# Altium project SiPM_ASSY2.PrjPCB
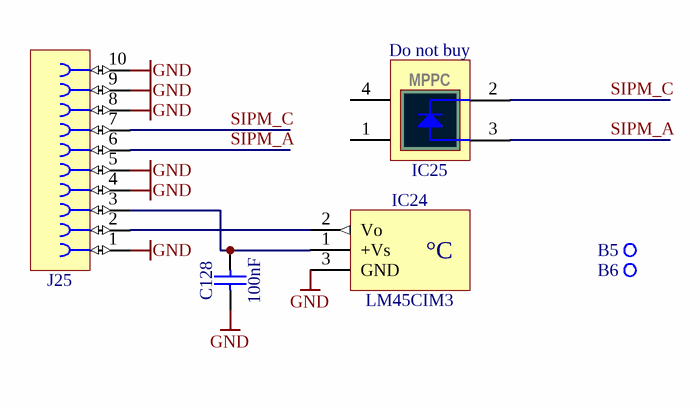
[diagram p0: SiPM_ASSY2.SchDoc]
1 sheet, 6 parts. Net scope: hierarchical (ports join the sheet entries above them; power ports are global).
Board file: SiPM_ASSY2.PCBDOC

## Sheet SiPM_ASSY2.SchDoc: MCORD AFE
size 420 x 297 mm; Author: G.Kasprowicz; CompanyName: WUT ISE; DrawnBy: G.Kasprowicz; Organization: WUT ISE; Address1: PW ISE; Address2: Nowowiejska 15/19 00-665 Warsaw; Address3: gkasprow@gmail.com; DocumentNumber: 1; Revision: 2; SheetNumber: 1; SheetTotal: 4; ModifiedBy: -; CheckedDate: -; Title2: top; DivGrp: WUT ISE; Designer: G.Kasprowicz; ModifiedDate: -; ProjectName: Sensor Box

### Parts
B5  Plated Hole  [MTG270_500]  (value not drawn)  (no BOM)
B6  Plated Hole  [MTG270_500]  (value not drawn)  (no BOM)
C128  100nF  [CAPC1005X55N]
IC24  LM45CIM3  [SOT95P251X112-3N]
IC25  Do not buy  [HAMAMATSU_S13360-1325PE]
J25  FFC/FPC  [MOLEX_52745-1097]  (value not drawn)

### Nets
GND: C128.1 IC24.3(GND) J25.1 J25.4 J25.5 J25.8 J25.9 J25.10
SIPM_A: IC25.3(A) J25.6
SIPM_C: IC25.2(C) J25.7
NetC128_2: C128.2 IC24.1(+Vs) J25.3
NetIC24_2: IC24.2(Vo) J25.2

Not connected (* = marked no-connect by the designer): B5 1; B6 1; IC25 1(NC) 4(NC)

### Notes on the sheet
- Project/Equipment
- Document
- Designer
- Drawn by
- Check.by
- Copyright WUT ISE 2018.
  This documentation describes Open Hardware and is licensed under the CERN OHL v.1.1. You may redistribute and modify this documentation under the terms of the CERN OHL v.1.1. (http://ohwr.org/CERNOHL). This documentation is distributed WITHOUT ANY EXPRESS OR IMPLIED WARRANTY, INCLUDING OF MERCHANTABILITY, SATISFACTORY QUALITY AND FITNESS FOR A PARTICULAR PURPOSE. Please see the CERN OHL v.1.1 for applicable conditions.
- Contact
- File
- Last Mod.
- Print Date
- Sheet
- Size
- A3
- of
- Rev
- (in symbol LM45CIM3) °C
- (in symbol SENS_S13360-1325PE) MPPC

### Library data of the parts
B5 B6 = PLATED_HOLE2.7_PAD5.0: Single Terminal Socket; Part Description: Plated Through Hole: Hole Dia.=2.7mm Pad Dia.=5.0mm; Mounted: No; Part Number: PLATED_HOLE2.7_PAD5.0; Component Type: Standard (No BOM); Pin Count: 1; Family: Plated Hole; Socket: No; SMD: No; Sense: No; Status: None; ComponentHeight: 0mm; HelpURL: Undefined; Author: CERN DEM JMW; CreateDate: 27.09.2011; LatestRevisionDate: 27.09.2011; PackageDescription: Plated Through Hole: Hole Dia.=2.7mm Pad Dia.=5.0mm
C128 = CC0402_100NF_16V_10%_X7R: Non-polarised capacitor; Part Description: SMD Multilayer Chip Ceramic Capacitor; Manufacturer: GENERIC; Manufacturer1 Part Number: GRM155R71C104KA88D; Voltage: 16V; TC: X7R; Tolerance: ±10%; Part Number: CC0402_100NF_16V_10%_X7R; Component Kind: Standard; Component Type: Standard; Pin Count: 2; Value: 100nF; Status: Not Recommended; Manufacturer Part Number: CC0402_100NF_16V_10%_X7R; Case: 0402; Mounted: Yes; Socket: No; SMD: Yes; Sense: No; HelpURL: \\cern.ch\dfs\Applications\Altium\Datasheets\CC0402_X7R_MURATA_GRM.pdf; Author: CERN DEM JLC; CreateDate: 05.12.2013; LatestRevisionDate: 03.12.2007; Manufacturer1 Example: MURATA; Manufacturer1 ComponentHeight: 0.55mm
IC24 = LM45CIM3: -20° to +100°C ±3°C Precision Centigrade Temperature Sensors; Manufacturer: NATIONAL SEMICONDUCTOR; PressFit: No; Bonding: No; Part Number: LM45CIM3; Component Kind: Standard; Component Type: Standard; Device: LM45CIM3; PackageDescription: SOT23 3-Leads, Pitch 0.95mm - Body 1.3x2.9mm, IPC Medium Density; Status: Obsolete; Part Description: -20° to +100°C ±3°C Precision Centigrade Temperature Sensors; Manufacturer Part Number: LM45CIM3; Pin Count: 3; Case: SOT23; Mounted: Yes; Socket: No; SMD: Yes; Sense: No; ComponentHeight: 1.12mm; HelpURL: \\cern.ch\dfs\Applications\Altium\Datasheets\LM45CIM3.pdf; Author: CERN DEM JLC; CreateDate: 02.12.2009; LatestRevisionDate: 02.12.2009
IC25 = SENS_S13360-1325PE: MPPC (Multi-Pixel Photon Counter); Part Description: 1.3 x 1.3mm2, 25µm Pixel Pitch, SMD MPPC (Multi-Pixel Photon Counter); Manufacturer: HAMAMATSU; PressFit: No; Bonding: No; Part Number: S13360-1325PE; Component Kind: Standard; Component Type: Standard; Device: S13360-1325PE; PackageDescription: 1.3 x 1.3mm2, 25µm Pixel Pitch, SMD MPPC (Multi-Pixel Photon Counter, Body 2.1mm x mm x 2.625mm x 1mm; Manufacturer Part Number: S13360-1325PE; Pin Count: 4; Mounted: Yes; Socket: No; SMD: Yes; Sense: No; ComponentHeight: 1mm; HelpURL: \\cern.ch\dfs\Applications\Altium\Datasheets\S13081-050PE.pdf; Author: GK; CreateDate: 01.04.2015; LatestRevisionDate: 01.04.2015
J25 = MOLEX_52745-1097: Connector 10 Female; Part Description: 10 Contacts, 0.5mm Pitch, Right Angled Surface Mount FFC/FPC Connector, ZIF, Top Contact Style; Manufacturer: MOLEX; PressFit: No; Part Number: MOLEX_52745-1097; Component Kind: Standard; Component Type: Standard; Pin Count: 10; Family: FFC/FPC; Mounted: Yes; Socket: No; SMD: Yes; Sense: No; Status: None; Manufacturer Part Number: 52745-1097; ComponentHeight: 2mm; HelpURL: \\cern.ch\dfs\Applications\Altium\Datasheets\MOLEX_52745-1097.pdf; Author: CERN DEM JLC; CreateDate: 04.11.2014; LatestRevisionDate: 05.12.2014